# Altium project DK2.PRJPCB (part 2 of 2)

## Sheet IRLED.SchDoc: OCULUS RIFT DEVELOPMENT KIT 2 (DK2) MAIN BOARD
size B; Date: 12 MAR 2014; Author: L. BAINBRIDGE; CompanyName: Oculus VR, Inc.; DrawnBy: L. BAINBRIDGE; Engineer: L. BAINBRIDGE; Organization: Oculus VR, Inc.; DocumentNumber: 6; Revision: 3.3; SheetNumber: 6; SheetTotal: 6; PageSetup: Record=PageOptions|CenterHorizontal=True|CenterVertical=True|PrintScale=1.12|XCorrection=1.00|YCorrection=1.00|PrintKind=1|BorderSize=5000000|LeftOffset=0|BottomOffset=0|Orientation=2|PaperLength=1000|PaperWidth=1000|Scale=100|PaperSource=15|PrintQuality=1200|MediaType=1|DitherType=0|PaperKind=11 x 17|PrintScaleMode=1; SheetDescription: IR LED DRIVERS, POWER SUPPLY AND FPC FLEX CONNECTOR; PartNumber: N/A; ProjectName: DK2
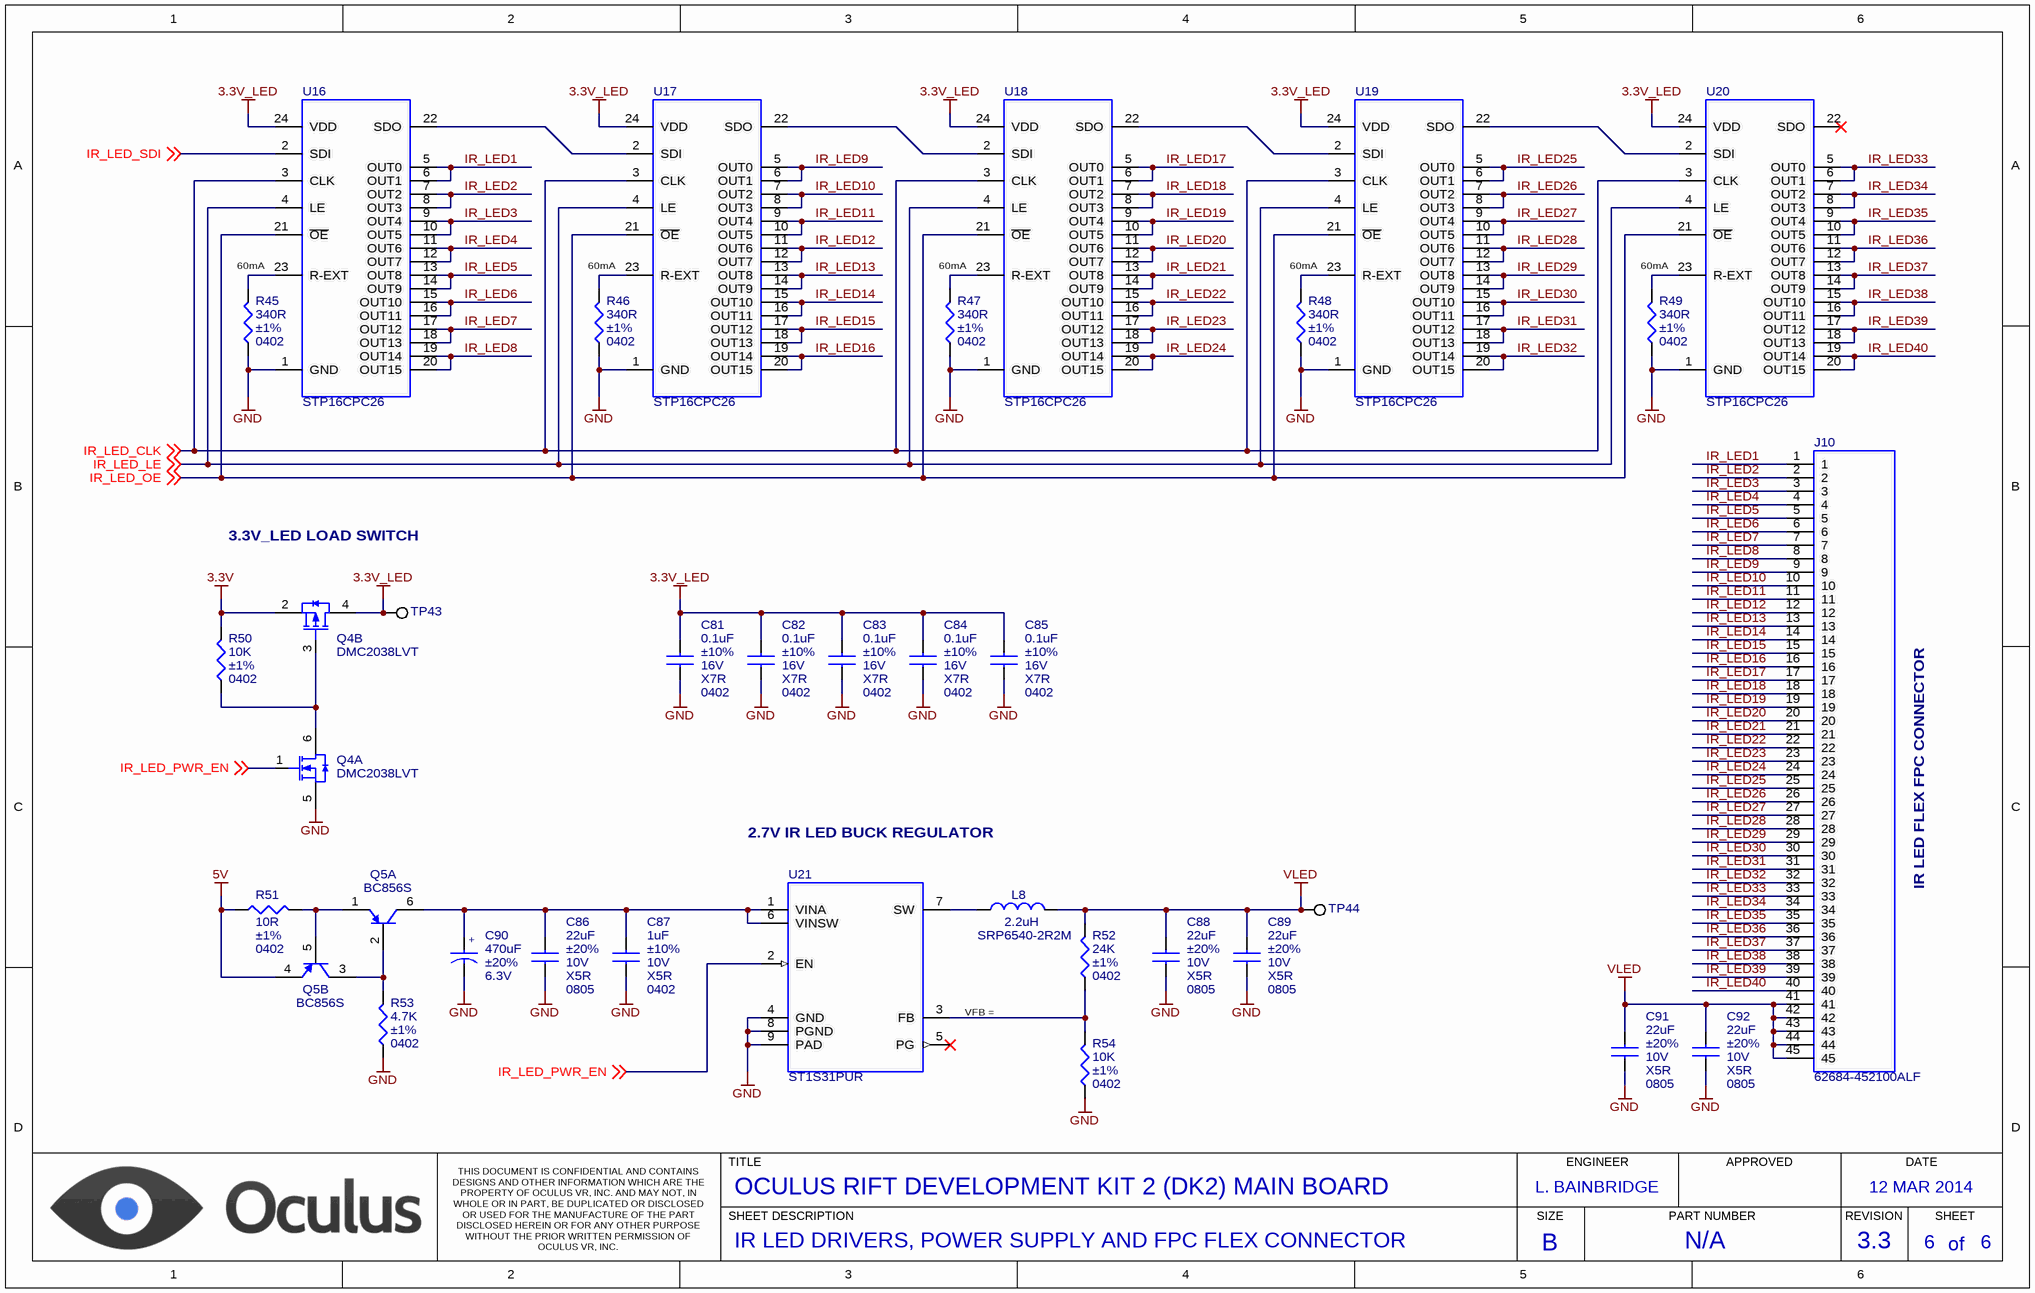
[diagram p5: IRLED.SchDoc]

### Parts
C81  0.1uF  Tolerance: ±10%  Voltage: 16V  Dielectric: X7R  Package: 0402  [CAP_CERAMIC_0402]
C82  0.1uF  Tolerance: ±10%  Voltage: 16V  Dielectric: X7R  Package: 0402  [CAP_CERAMIC_0402]
C83  0.1uF  Tolerance: ±10%  Voltage: 16V  Dielectric: X7R  Package: 0402  [CAP_CERAMIC_0402]
C84  0.1uF  Tolerance: ±10%  Voltage: 16V  Dielectric: X7R  Package: 0402  [CAP_CERAMIC_0402]
C85  0.1uF  Tolerance: ±10%  Voltage: 16V  Dielectric: X7R  Package: 0402  [CAP_CERAMIC_0402]
C86  22uF  Tolerance: ±20%  Voltage: 10V  Dielectric: X5R  Package: 0805  [CAP_CERAMIC_0805]
C87  1uF  Tolerance: ±10%  Voltage: 10V  Dielectric: X5R  Package: 0402  [CAP_CERAMIC_0402]
C88  22uF  Tolerance: ±20%  Voltage: 10V  Dielectric: X5R  Package: 0805  [CAP_CERAMIC_0805]
C89  22uF  Tolerance: ±20%  Voltage: 10V  Dielectric: X5R  Package: 0805  [CAP_CERAMIC_0805]
C90  470uF  Voltage: 6.3V  Tolerance: ±20%  [7343-38]
C91  22uF  Tolerance: ±20%  Voltage: 10V  Dielectric: X5R  Package: 0805  [CAP_CERAMIC_0805]
C92  22uF  Tolerance: ±20%  Voltage: 10V  Dielectric: X5R  Package: 0805  [CAP_CERAMIC_0805]
J10  62684-452100ALF  [FCI_62684-452100ALF]
L8  2.2uH  Part Number: SRP6540-2R2M  [SRP6540]
Q4  DMC2038LVT  [TSOT26]  (parts A,B of 2)
Q5  BC856S  [SOT363]  (parts A,B of 2)
R45  340R  Package: 0402  Tolerance: ±1%  [RESISTOR_0402]
R46  340R  Package: 0402  Tolerance: ±1%  [RESISTOR_0402]
R47  340R  Package: 0402  Tolerance: ±1%  [RESISTOR_0402]
R48  340R  Package: 0402  Tolerance: ±1%  [RESISTOR_0402]
R49  340R  Package: 0402  Tolerance: ±1%  [RESISTOR_0402]
R50  10K  Package: 0402  Tolerance: ±1%  [RESISTOR_0402]
R51  10R  Package: 0402  Tolerance: ±1%  [RESISTOR_0402]
R52  24K  Package: 0402  Tolerance: ±1%  [RESISTOR_0402]
R53  4.7K  Package: 0402  Tolerance: ±1%  [RESISTOR_0402]
R54  10K  Package: 0402  Tolerance: ±1%  [RESISTOR_0402]
TP43  TEST POINT  [TEST_POINT_PAD_1MM]  (value not drawn)  (no BOM)
TP44  TEST POINT  [TEST_POINT_PAD_1MM]  (value not drawn)  (no BOM)
U16  STP16CPC26  [TSSOP24]
U17  STP16CPC26  [TSSOP24]
U18  STP16CPC26  [TSSOP24]
U19  STP16CPC26  [TSSOP24]
U20  STP16CPC26  [TSSOP24]
U21  ST1S31PUR  [VFDFPN-3x3-8L]

### Nets
3.3V: Q4.2(S) R50.2
3.3V_LED: C81.1 C82.1 C83.1 C84.1 C85.1 Q4.4(D) TP43.1 U16.24(VDD) U17.24(VDD) U18.24(VDD) U19.24(VDD) U20.24(VDD)
5V: Q5.4(E) R51.1
GND: C81.2 C82.2 C83.2 C84.2 C85.2 C86.2 C87.2 C88.2 C89.2 C90.2 C91.2 C92.2 Q4.5(S) R45.1 R46.1 R47.1 R48.1 R49.1 R53.1 R54.1 U16.1(GND) U17.1(GND) U18.1(GND) U19.1(GND) U20.1(GND) U21.4(GND) U21.8(PGND) U21.9(PAD)
VLED: C88.1 C89.1 C91.1 C92.1 J10.41 J10.42 J10.43 J10.44 J10.45 L8.1 R52.2 TP44.1
IR_LED1: J10.1 U16.5(OUT0) U16.6(OUT1)
IR_LED2: J10.2 U16.7(OUT2) U16.8(OUT3)
IR_LED3: J10.3 U16.9(OUT4) U16.10(OUT5)
IR_LED4: J10.4 U16.11(OUT6) U16.12(OUT7)
IR_LED5: J10.5 U16.13(OUT8) U16.14(OUT9)
IR_LED6: J10.6 U16.15(OUT10) U16.16(OUT11)
IR_LED7: J10.7 U16.17(OUT12) U16.18(OUT13)
IR_LED8: J10.8 U16.19(OUT14) U16.20(OUT15)
IR_LED9: J10.9 U17.5(OUT0) U17.6(OUT1)
IR_LED10: J10.10 U17.7(OUT2) U17.8(OUT3)
IR_LED11: J10.11 U17.9(OUT4) U17.10(OUT5)
IR_LED12: J10.12 U17.11(OUT6) U17.12(OUT7)
IR_LED13: J10.13 U17.13(OUT8) U17.14(OUT9)
IR_LED14: J10.14 U17.15(OUT10) U17.16(OUT11)
IR_LED15: J10.15 U17.17(OUT12) U17.18(OUT13)
IR_LED16: J10.16 U17.19(OUT14) U17.20(OUT15)
IR_LED17: J10.17 U18.5(OUT0) U18.6(OUT1)
IR_LED18: J10.18 U18.7(OUT2) U18.8(OUT3)
IR_LED19: J10.19 U18.9(OUT4) U18.10(OUT5)
IR_LED20: J10.20 U18.11(OUT6) U18.12(OUT7)
IR_LED21: J10.21 U18.13(OUT8) U18.14(OUT9)
IR_LED22: J10.22 U18.15(OUT10) U18.16(OUT11)
IR_LED23: J10.23 U18.17(OUT12) U18.18(OUT13)
IR_LED24: J10.24 U18.19(OUT14) U18.20(OUT15)
IR_LED25: J10.25 U19.5(OUT0) U19.6(OUT1)
IR_LED26: J10.26 U19.7(OUT2) U19.8(OUT3)
IR_LED27: J10.27 U19.9(OUT4) U19.10(OUT5)
IR_LED28: J10.28 U19.11(OUT6) U19.12(OUT7)
IR_LED29: J10.29 U19.13(OUT8) U19.14(OUT9)
IR_LED30: J10.30 U19.15(OUT10) U19.16(OUT11)
IR_LED31: J10.31 U19.17(OUT12) U19.18(OUT13)
IR_LED32: J10.32 U19.19(OUT14) U19.20(OUT15)
IR_LED33: J10.33 U20.5(OUT0) U20.6(OUT1)
IR_LED34: J10.34 U20.7(OUT2) U20.8(OUT3)
IR_LED35: J10.35 U20.9(OUT4) U20.10(OUT5)
IR_LED36: J10.36 U20.11(OUT6) U20.12(OUT7)
IR_LED37: J10.37 U20.13(OUT8) U20.14(OUT9)
IR_LED38: J10.38 U20.15(OUT10) U20.16(OUT11)
IR_LED39: J10.39 U20.17(OUT12) U20.18(OUT13)
IR_LED40: J10.40 U20.19(OUT14) U20.20(OUT15)
IR_LED_CLK: U16.3(CLK) U17.3(CLK) U18.3(CLK) U19.3(CLK) U20.3(CLK) ; off-sheet IR_LED_CLK
IR_LED_LE: U16.4(LE) U17.4(LE) U18.4(LE) U19.4(LE) U20.4(LE) ; off-sheet IR_LED_LE
IR_LED_OE: U16.21(~{OE}) U17.21(~{OE}) U18.21(~{OE}) U19.21(~{OE}) U20.21(~{OE}) ; off-sheet IR_LED_OE
IR_LED_PWR_EN: Q4.1(G) U21.2(EN) ; off-sheet IR_LED_PWR_EN
IR_LED_SDI: U16.2(SDI) ; off-sheet IR_LED_SDI
NetC86_1: C86.1 C87.1 C90.1 Q5.6(C) U21.1(VINA) U21.6(VINSW)
NetL8_2: L8.2 U21.7(SW)
NetQ4_3: Q4.3(G) Q4.6(D) R50.1
NetQ5_1: Q5.1(E) Q5.5(B) R51.2
NetQ5_2: Q5.2(B) Q5.3(C) R53.2
NetR45_2: R45.2 U16.23(R-EXT)
NetR46_2: R46.2 U17.23(R-EXT)
NetR47_2: R47.2 U18.23(R-EXT)
NetR48_2: R48.2 U19.23(R-EXT)
NetR49_2: R49.2 U20.23(R-EXT)
NetR52_1: R52.1 R54.2 U21.3(FB)
NetU16_22: U16.22(SDO) U17.2(SDI)
NetU17_22: U17.22(SDO) U18.2(SDI)
NetU18_22: U18.22(SDO) U19.2(SDI)
NetU19_22: U19.22(SDO) U20.2(SDI)

Not connected (* = marked no-connect by the designer): U20 22(SDO)*; U21 5(PG)*

### Notes on the sheet
- 60mA
- 3.3V_LED LOAD SWITCH
- 2.7V IR LED BUCK REGULATOR
- IR LED FLEX FPC CONNECTOR
- (near U21) VFB = 0.8V
- TITLE
- ENGINEER
- APPROVED
- DATE
- THIS DOCUMENT IS CONFIDENTIAL AND CONTAINS DESIGNS AND OTHER INFORMATION WHICH ARE THE PROPERTY OF OCULUS VR, INC. AND MAY NOT, IN WHOLE OR IN PART, BE DUPLICATED OR DISCLOSED OR USED FOR THE MANUFACTURE OF THE PART DISCLOSED HEREIN OR FOR ANY OTHER PURPOSE WITHOUT THE PRIOR WRITTEN PERMISSION OF OCULUS VR, INC.
- SHEET DESCRIPTION
- SIZE
- PART NUMBER
- REVISION
- SHEET
- of
- B
- (in symbol CAP, TANTALUM) +

### Library data of the parts
C81-C85 = CAP, CERAMIC: CAP, CERAMIC, 0.1uF, ±10%, 16V, X7R, 0402; Manufacturer: MURATA ELECTRONICS; Part Number: GRM155R71C104KA88D
C86 C88 C89 C91 C92 = CAP, CERAMIC: CAP, CERAMIC, 22uF, ±20%, 10V, X5R, 0805; Manufacturer: SAMSUNG; Part Number: CL21A226MPQNNNE
C87 = CAP, CERAMIC: CAP, CERAMIC, 1uF, ±10%, 10V, X5R, 0402; Manufacturer: MURATA ELECTRONICS; Part Number: GRM155R61A105KE15D
C90 = CAP, TANTALUM: CAP, TANTALUM, 470uF, ±20%, 6.3V, 7343-38; Manufacturer: PANASONIC; Part Number: 6TPB470M; ESR: 35 mOHM; Package: 7343-38
J10 = 62684-452100ALF: CONNECTOR, FPC HEADER, 45 POS, 0.5MM PITCH; Manufacturer: FCI; Part Number: 62684-452100ALF
L8 = INDUCTOR: INDUCTOR, SHIELDED POWER, 2.2uH, 9A; Manufacturer: BOURNES
Q4 = DMC2038LVT: FET, COMPLEMENTARY, LOGIC LEVEL; Manufacturer: DIODES INC; Part Number: DMC2038LVT
Q5 = BC856S: TRANSISTOR, DUAL SILICON PNP; Manufacturer: INFINEON; Part Number: BC856S H6327
R45-R49 = RESISTOR: RES 340 OHM, 1/10W, ±1%, 0402; Manufacturer: PANASONIC; Part Number: ERJ-2RKF3400X; Power Rating: 1/10W
R50 R54 = RESISTOR: RES, 10K OHM, 1/10W, ±1%, 0402; Manufacturer: PANASONIC; Part Number: ERJ-2RKF1002X; Power Rating: 1/10W
R51 = RESISTOR: RES, 10 OHM, 1/10W, ±1%, 0402; Manufacturer: PANASONIC; Part Number: ERJ-2RKF10R0X; Power Rating: 1/10W
R52 = RESISTOR: RES, 24K OHM, 1/10W, ±1%, 0402; Manufacturer: PANASONIC; Part Number: ERJ-2RKF2402X; Power Rating: 1/10W
R53 = RESISTOR: RES, 4.7K OHM, 1/10W, ±1%, 0402; Manufacturer: PANASONIC; Part Number: ERJ-2RKF4701X; Power Rating: 1/10W
TP43 TP44 = TEST_POINT_GENERIC: Manufacturer: *; Part Number: *
U16-U20 = STP16CPC26: IC, LED DRIVER, 16-BIT CONSTANT CURRENT SINK DRIVER; Manufacturer: STMICROELECTRONICS; Part Number: STP16CPC26TTR
U21 = ST1S31PUR: IC, BUCK REGULATOR, 3A; Manufacturer: STMICROELECTRONICS; Part Number: ST1S31PUR; Pinout verified: *

## Nets that join several sheets
1.2V: VIDEO (FB2.1 FB3.1 FB4.1 FB5.1), POWER (5 pins)
3.0V: MICRO (21 pins), USBHUB (6 pins), SENSOR (C55.1 C59.1 L1.2 L2.2), POWER (5 pins)
3.0V_SW: VIDEO (C1.1 FB1.1 J1.19 J1.23), MICRO (C93.1 C94.1 U22.5 U23.5), POWER (Q1.4 TP33.1)
3.3V: USBHUB (15 pins), POWER (12 pins), IRLED (Q4.2 R50.2)
3.3V_SW: VIDEO (FB6.1), POWER (10 pins)
5V: MICRO (R7.2 R8.2), USBHUB (6 pins), POWER (5 pins), IRLED (Q5.4 R51.1)
ELAVDD: VIDEO (J1.21), POWER (C79.1 FB11.2 TP42.1)
ELVDD: VIDEO (J1.35 J1.37 J1.39), POWER (C78.1 FB9.2 TP40.1)
ELVSS: VIDEO (J1.36 J1.38 J1.40), POWER (C69.1 C77.1 Q3.6 TP38.1)
GND: VIDEO (84 pins), MICRO (39 pins), USBHUB (62 pins), SENSOR (14 pins), POWER (36 pins), IRLED (28 pins)
ACC_LED_EN: MICRO (U5.24), USBHUB (D5.2)
ACC_PWR_EN: MICRO (U5.57), USBHUB (R16.1 U9.4)
ACC_PWR_FAULT: MICRO (U5.51), USBHUB (R15.1 U6.24 U9.3)
BRIDGE_1.2V_EN: MICRO (U5.3), POWER (R34.2 U14.6)
BRIDGE_IRQ: VIDEO (U1.J4), MICRO (U5.2)
BRIDGE_PWR_EN: VIDEO (Q6.1), MICRO (U5.26), POWER (Q1.1 Q2.1)
BRIDGE_RESET: VIDEO (U1.K6), MICRO (U5.40)
BRIDGE_STBY: VIDEO (U1.K4 Y1.1), MICRO (U5.4)
D1USBD_N: MICRO (U5.44), USBHUB (R13.2)
D1USBD_P: MICRO (U5.45), USBHUB (R14.2)
GYRO_CS: MICRO (RA2.5), SENSOR (U11.22)
GYRO_IRQ: MICRO (U5.16), SENSOR (U11.12)
HDMI_5V: VIDEO (C96.1 R28.1), MICRO (U5.62)
HUB_I2C_EN: MICRO (U5.10), USBHUB (R27.2 U24.5)
HUB_RESET: MICRO (U5.54), USBHUB (C50.1 R17.1 R20.2 U6.17)
HUB_SELFPWR: MICRO (U5.53), USBHUB (R22.2 U6.22)
I2C1_SCL: MICRO (U5.58 U10.6), USBHUB (R25.1 U24.2 U25.6)
I2C1_SDA: MICRO (U5.59 U10.5), USBHUB (R26.1 U24.3 U25.5)
I2C2_SCL: VIDEO (R2.1 U1.J5), MICRO (U5.29)
I2C2_SDA: VIDEO (R3.1 U1.K5), MICRO (U5.30)
I2C_SCL_PU_EN: MICRO (U5.27), USBHUB (R25.2)
IR_LED_CLK: MICRO (RA1.6), IRLED (5 pins)
IR_LED_LE: MICRO (RA1.7), IRLED (5 pins)
IR_LED_OE: MICRO (RA1.5), IRLED (5 pins)
IR_LED_PWR_EN: MICRO (R10.2 U5.28), IRLED (Q4.1 U21.2)
IR_LED_SDI: MICRO (RA1.8), IRLED (U16.2)
MAG_CS: MICRO (U5.37), SENSOR (U12.10)
MAG_DRDY: MICRO (U5.25), SENSOR (U12.8)
MCO: MICRO (U5.41), USBHUB (TP12.1 U6.10)
MEMS_MISO: MICRO (RA2.7), SENSOR (U11.9 U12.9)
MEMS_MOSI: MICRO (RA2.8), SENSOR (U11.24 U12.11)
MEMS_SCK: MICRO (RA2.6), SENSOR (U11.23 U12.1)
PANEL_EL_ON_1: VIDEO (J1.15), POWER (TP46.1 U15.8)
PANEL_EL_ON_2: VIDEO (J1.17), POWER (TP47.1 U15.9)
PANEL_MIPI_ERR_1_8V: VIDEO (J1.27), MICRO (U22.1 U22.2)
PANEL_PWM: MICRO (U5.55), POWER (R38.1)
PANEL_RESET: VIDEO (J1.29), MICRO (U5.11)
PANEL_VSYNC_1_8V: VIDEO (J1.13), MICRO (U23.1 U23.2)
USB_SUSPEND: MICRO (U5.52), USBHUB (R23.2 U6.23)
WW_DETECT: MICRO (U5.61), USBHUB (D8.1 J8.4 R18.2)